# Altium schematic sheet Weerstation.SchDoc
size A3; SheetNumber: 1; SheetTotal: 1
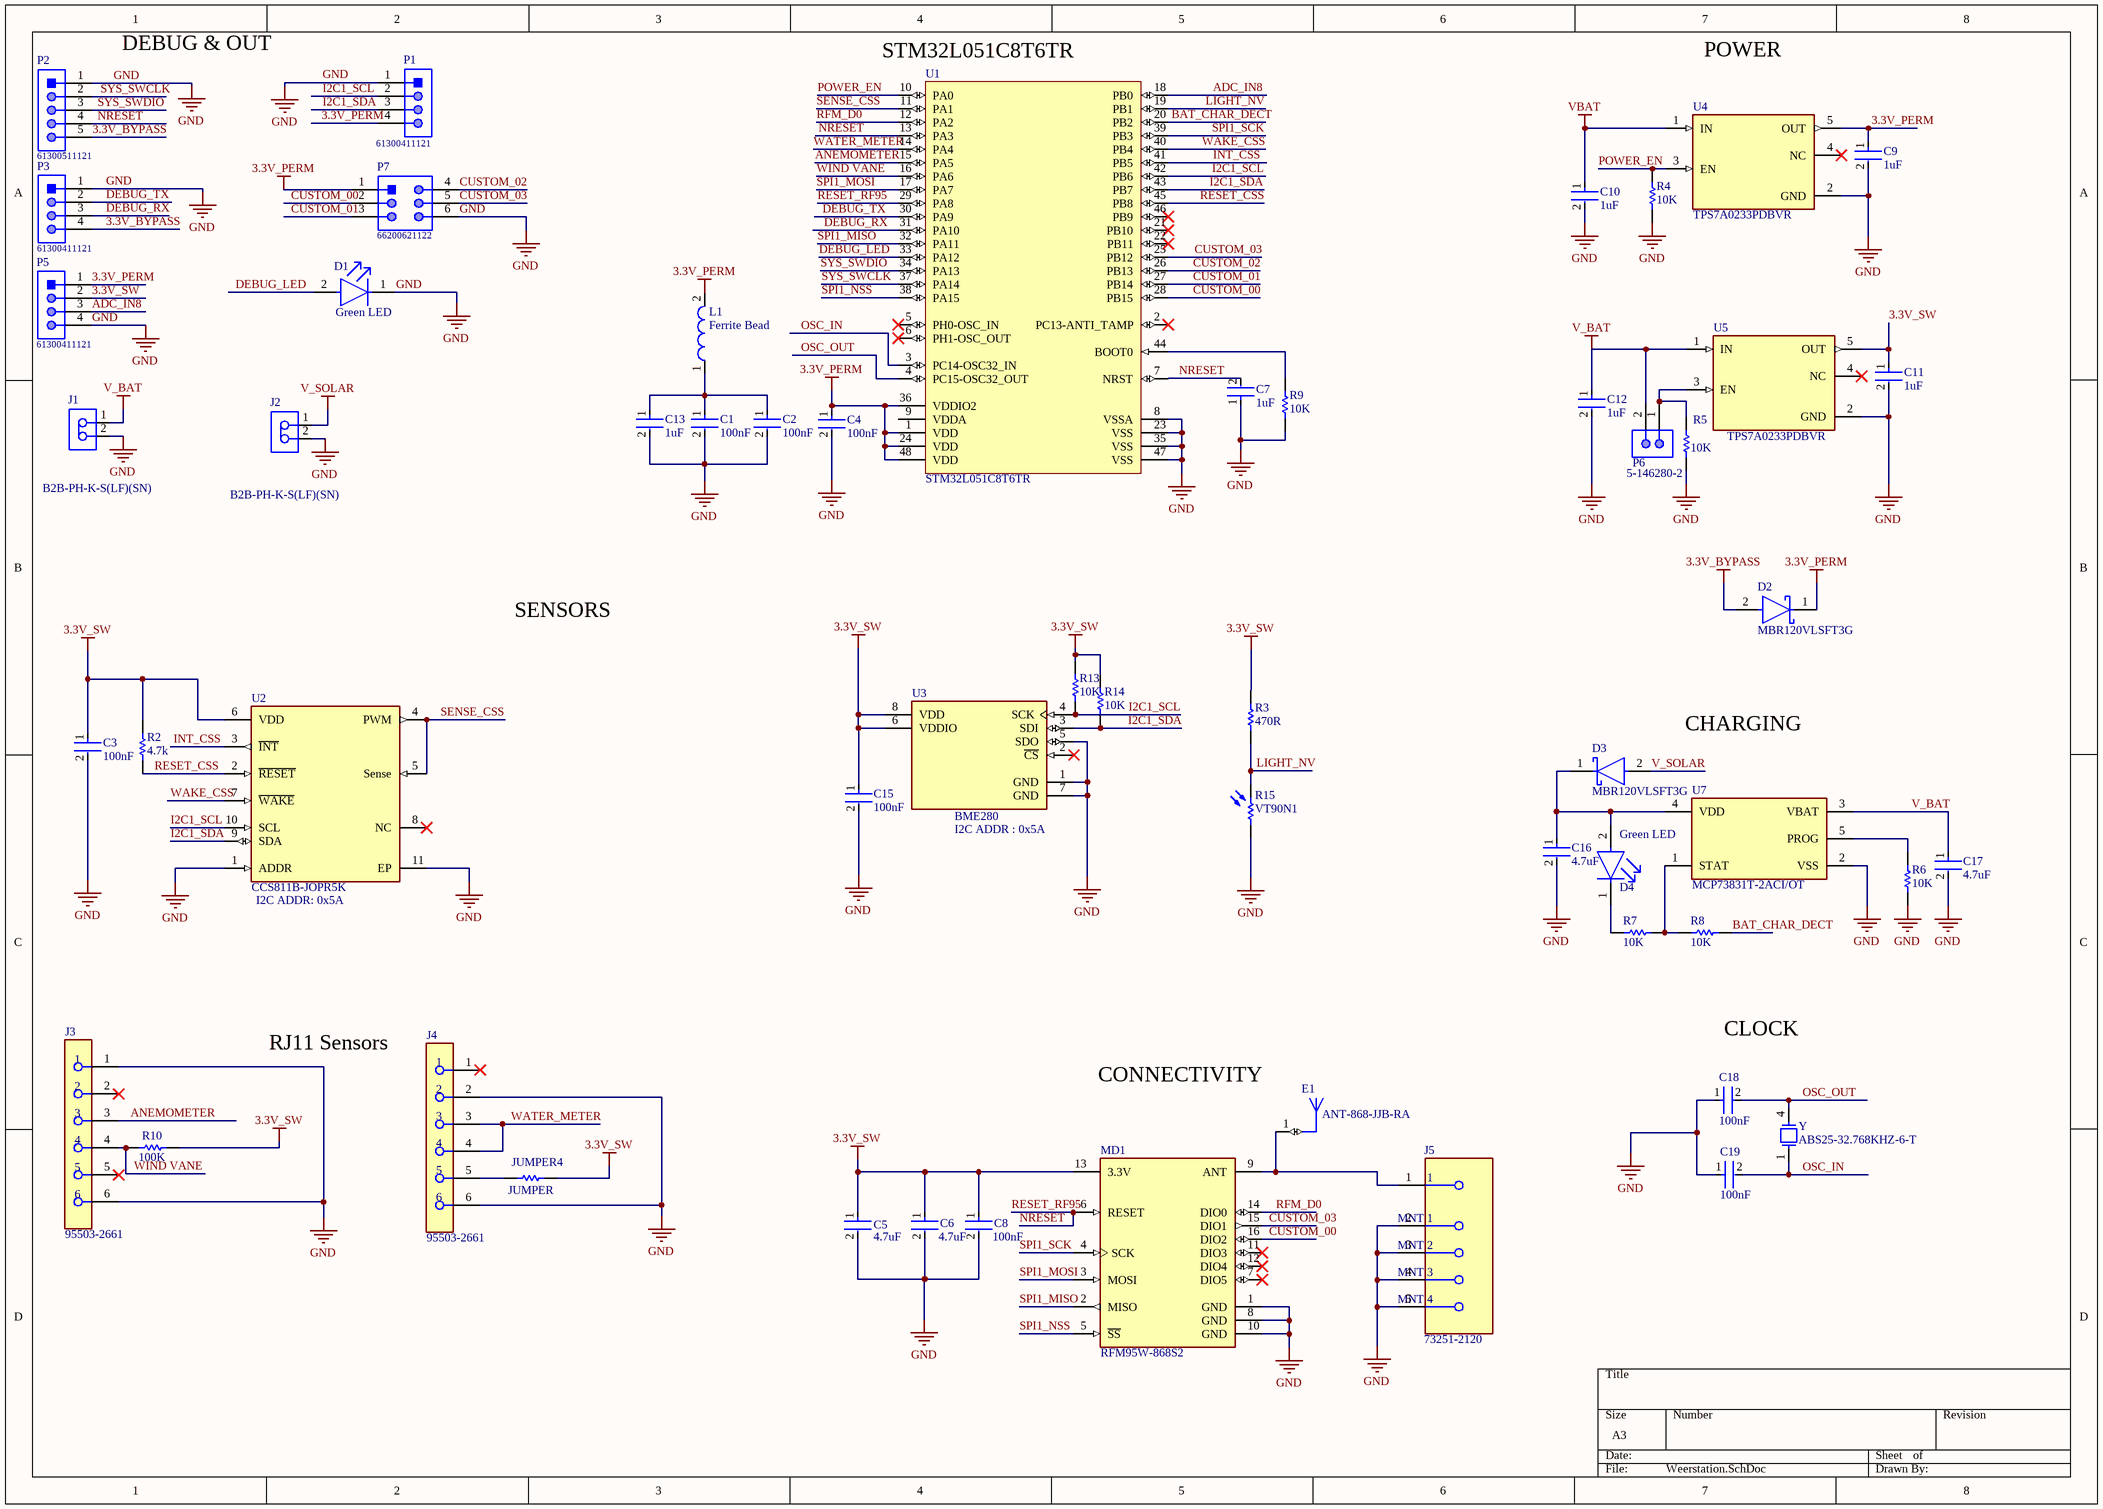
[diagram p0: Weerstation.SchDoc]

## Parts
C1  100nF  [FP-C0603C105K3PACTU-MFG]
C2  100nF  [FP-C0603C105K3PACTU-MFG]
C3  100nF  [FP-C0603C105K3PACTU-MFG]
C4  100nF  [FP-CGA3E-0_3-0_1-IPC_A]
C5  4.7uF  [FP-C0603-CG-MFG]
C6  4.7uF  [FP-C0603-CG-MFG]
C7  1uF  [FP-C0603C105K3PACTU-MFG]
C8  100nF  [FP-C0603C105K3PACTU-MFG]
C9  1uF  [FP-C0603C105K3PACTU-MFG]
C10  1uF  [FP-C0603-CG-MFG]
C11  1uF  [FP-C0603C105K3PACTU-MFG]
C12  1uF  [FP-C0603-CG-MFG]
C13  1uF  [FP-C0603C105K3PACTU-MFG]
C15  100nF  [FP-C0603C105K3PACTU-MFG]
C16  4.7uF  [FP-C0603-CG-MFG]
C17  4.7uF  [FP-C0603-CG-MFG]
C18  100nF  [FP-CGA3E-0_3-0_1-IPC_A]
C19  100nF  [FP-CGA3E-0_3-0_1-IPC_A]
D1  Green LED  [FP-LTST-C190GKT-MFG]
D2  MBR120VLSFT3G  [FP-498-MFG]
D3  MBR120VLSFT3G  [FP-498-MFG]
D4  Green LED  [FP-LTST-C190GKT-MFG]
E1  ANT-868-JJB-RA  [ANT-XXX-JJB-RA]
J1  B2B-PH-K-S(LF)(SN)  [JST-B2B-PH-K-S_V]
J2  B2B-PH-K-S(LF)(SN)  [JST-B2B-PH-K-S_V]
J3  95503-2661  [FP-95503-2661-MFG]
J4  95503-2661  [FP-95503-2661-MFG]
J5  73251-2120  [FP-73251-2120-MFG]
JUMPER4  JUMPER  [RESC2013X50X30LL20T20]
L1  Ferrite Bead  [SMD-0603]
MD1  RFM95W-868S2  [FP-RFM95W-868S2-MFG]
P1  61300411121  [61300411121]
P2  61300511121  [61300511121]
P3  61300411121  [61300411121]
P5  61300411121  [61300411121]
P6  5-146280-2  [TECO-5-146280-2_V]
P7  66200621122  [66200621122]
R2  4.7k  [RESC1608X55X30ML15T15]
R3  470R  [RESC1608X55X30ML15T15]
R4  10K  [RESC1608X55X30ML15T15]
R5  10K  [RESC1608X55X30ML15T15]
R6  10K  [RESC1608X55X30ML15T15]
R7  10K  [RESC1608X55X30ML15T15]
R8  10K  [RESC1608X55X30ML15T15]
R9  10K  [RESC1608X55X30ML15T15]
R10  100K  [RESC1608X55X30ML15T15]
R13  10K  [RESC1608X55X30ML15T15]
R14  10K  [RESC1608X55X30ML15T15]
R15  VT90N1  [EXCE-VT90N1]
U1  STM32L051C8T6TR  [STM-LQFP48_N]
U2  CCS811B-JOPR5K  [FP-CCS811B-JOPR5K-MFG]
U3  BME280  [FP-BME280-MFG]
U4  TPS7A0233PDBVR  [FP-DBV0005A-IPC_B]
U5  TPS7A0233PDBVR  [FP-DBV0005A-IPC_B]
U7  MCP73831T-2ACI/OT  [FP-C04-091-OT-IPC_A]
Y  ABS25-32.768KHZ-6-T  [XTAL_ABS25-32.768KHZ-6-T]

## Nets
3.3V_BYPASS: D2.2(A) P2.5 P3.4
3.3V_PERM: C4.1 C9.1 D2.1(C) L1.2 P1.4 P5.1 P7.1 U1.1(VDD) U1.24(VDD) U1.36(VDDIO2) U1.48(VDD) U4.5(OUT)
3.3V_SW: C3.1 C5.1 C6.1 C8.1 C11.1 C15.1 JUMPER4.1 MD1.13(3.3V) P5.2 R2.2 R3.1 R10.2 R13.1 R14.1 U2.6(VDD) U3.6(VDDIO) U3.8(VDD) U5.5(OUT)
GND: C1.2 C2.2 C3.2 C4.2 C5.2 C6.2 C7.1 C8.2 C9.2 C10.2 C11.2 C12.2 C13.2 C15.2 C16.2 C17.2 C18.1 C19.1 D1.1(C) J1.2 J2.2 J3.1 J3.6 J4.2 J4.6 J5.2(MNT_1) J5.3(MNT_2) J5.4(MNT_3) J5.5(MNT_4) MD1.1(GND) MD1.8(GND) MD1.10(GND) P1.1 P2.1 P3.1 P5.4 P7.6 R4.2 R5.2 R6.1 R9.1 R15.1 U1.8(VSSA) U1.23(VSS) U1.35(VSS) U1.47(VSS) U2.1(ADDR) U2.11(EP) U3.1(GND) U3.5(SDO) U3.7(GND) U4.2(GND) U5.2(GND) U7.2(VSS)
V_BAT: C12.1 C17.1 J1.1 P6.2 U5.1(IN) U7.3(VBAT)
V_SOLAR: D3.2(A) J2.1
VBAT: C10.1 U4.1(IN)
ADC_IN8: P5.3 U1.18(PB0)
ANEMOMETER: J3.3 U1.15(PA5)
BAT_CHAR_DECT: R8.1 U1.20(PB2)
CUSTOM_00: MD1.16(DIO2) P7.2 U1.28(PB15)
CUSTOM_01: P7.3 U1.27(PB14)
CUSTOM_02: P7.4 U1.26(PB13)
CUSTOM_03: MD1.15(DIO1) P7.5 U1.25(PB12)
DEBUG_LED: D1.2(A) U1.33(PA12)
DEBUG_RX: P3.3 U1.31(PA10)
DEBUG_TX: P3.2 U1.30(PA9)
I2C1_SCL: P1.2 R13.2 U1.42(PB6) U2.10(SCL) U3.4(SCK)
I2C1_SDA: P1.3 R14.2 U1.43(PB7) U2.9(SDA) U3.3(SDI)
INT_CSS: U1.41(PB5) U2.3(~{INT})
LIGHT_NV: R3.2 R15.2 U1.19(PB1)
NRESET: C7.2 MD1.6(RESET) P2.4 U1.7(NRST) U1.13(PA3) U1.29(PA8)  [also labelled RESET_RF95]
OSC_IN: C19.2 U1.3(PC14-OSC32_IN) Y.1
OSC_OUT: C18.2 U1.4(PC15-OSC32_OUT) Y.4
POWER_EN: R4.1 U1.10(PA0) U4.3(EN)
RESET_CSS: R2.1 U1.45(PB8) U2.2(~{RESET})
RFM_D0: MD1.14(DIO0) U1.12(PA2)
SENSE_CSS: U1.11(PA1) U2.4(PWM) U2.5(Sense)
SPI1_MISO: MD1.2(MISO) U1.32(PA11)
SPI1_MOSI: MD1.3(MOSI) U1.17(PA7)
SPI1_NSS: MD1.5(~{SS}) U1.38(PA15)
SPI1_SCK: MD1.4(SCK) U1.39(PB3)
SYS_SWCLK: P2.2 U1.37(PA14)
SYS_SWDIO: P2.3 U1.34(PA13)
WAKE_CSS: U1.40(PB4) U2.7(~{WAKE})
WATER_METER: J4.3 J4.4 U1.14(PA4)
WIND VANE: J3.4 R10.1 U1.16(PA6)
NetC1_1: C1.1 C2.1 C13.1 L1.1
NetC16_1: C16.1 D3.1(C) D4.2(A) U7.4(VDD)
NetD4_1: D4.1(C) R7.2
NetE1_1: E1.1(FEED) J5.1 MD1.9(ANT)
NetJ4_5: J4.5 JUMPER4.2
NetP6_1: P6.1 R5.1 U5.3(EN)
NetR6_2: R6.2 U7.5(PROG)
NetR7_1: R7.1 R8.2 U7.1(STAT)
NetR9_2: R9.2 U1.44(BOOT0)

Not connected (* = marked no-connect by the designer): J3 2* 5*; J4 1*; MD1 7(DIO5)* 11(DIO3)* 12(DIO4)*; U1 2(PC13-ANTI_TAMP)* 5(PH0-OSC_IN)* 6(PH1-OSC_OUT)* 9(VDDA) 21(PB10)* 22(PB11)* 46(PB9)*; U2 8(NC)*; U3 2(~{CS})*; U4 4(NC)*; U5 4(NC)*

## Notes on the sheet
- DEBUG & OUT
- (near U1) STM32L051C8T6TR
- POWER
- SENSORS
- CHARGING
- (near U3) I2C ADDR : 0x5A
- (near U2) I2C ADDR: 0x5A
- RJ11 Sensors
- CLOCK
- CONNECTIVITY

## Library data of the parts
C1-C3 C8 C15 = CMP-2006-02216-3: CAP CER 100nF 25V X5R 0603; Dielectric Material: Ceramic; Capacitance: 1uF; Tolerance: 10%; Contact Plating: Tin; Number of Pins: 2; Lead Free: Lead Free; Depth: 0.8mm; Length: 1.6mm; Mount: Surface Mount; Case Code (Metric): 1608; Max Operating Temperature: 85°C; Voltage: 25V; Voltage Rating (DC): 25V; REACH SVHC: No SVHC; Height: 0.8mm; Series: C0603C; Case/Package: 0603; Case Code (Imperial): 0603; RoHS Compliant: Yes; Dielectric: X5R; Packaging: Tape and Reel; Construction: Flat; Thickness: 0.034inch; Voltage Rating: 25V; Radiation Hardening: No; Width: 0.031inch; Min Operating Temperature: -55°C; Termination: SMD/SMT; Package Quantity: 4000
C4 = CMP-2000-07546-2: Cap Ceramic 100nF 50V X7R 10% Pad SMD 0603 +125°C Automotive T/R; Weight: 7.1E-05oz; Composition: Ceramic; Max Operating Temperature: 125°C; Termination: SMD/SMT; Dielectric: X7R; Length: 1.6mm; Package Quantity: 1; REACH SVHC: No SVHC; Lead Free: Lead Free; Case Code (Metric): 1608; Min Operating Temperature: -55°C; Packaging: Tape and Reel; Tolerance: 10%; Voltage Rating: 50V; Case Code (Imperial): 0603; Capacitance: 100nF; Case/Package: 0603; Voltage Rating (DC): 50V; Depth: 0.8mm; Radiation Hardening: No; Ratings: AEC-Q200; Mount: Surface Mount; Voltage: 50V; Thickness: 0.035inch; Width: 0.8mm; Height: 0.8mm
C5 C6 C10 C12 C16 C17 = CMP-2006-02256-2: CAP CER 4.7UF 6.3V X5R 0603; Manufacturer: Kemet; Manufacturer Part Number: C0603C475K9PACTU; Temperature Coefficient: 15%; Tolerance: 10%; Material: Ceramic; Device Class L3: Ceramic Capacitors; RoHS: TRUE; Value: 4.7uF; Lead Free: Yes; ComponentLink2Description: Datasheet; Mouser Description: Multilayer Ceramic Capacitors MLCC - SMD/SMT 6.3volts 4.7uF X5R 10%; Package: C0603-CG; Digikey Description: CAP CER 4.7UF 6.3V X5R 0603; ComponentLink2URL: https://content.kemet.com/datasheets/KEM_C1006_X5R_SMD.pdf; Category: Cap; Temperature Range Low: -55°C; Capacitance: 4.7uF; Temperature: -55°C to +85°C; Octopart: https://octopart.com/c0603c475k9pactu-kemet-104242; Ipc Land Pattern Name: CAPC16080X80; Voltage Rating: 6.3V; Temperature Range High: +85°C; Height: 0.9mm; Temperature Characteristic: X5R; Device Class L1: Passive Components; Automotive: No; Device Class L2: Capacitors
C7 C13 = CMP-2006-02216-3: CAP CER 1uF 25V X5R 0603; Dielectric Material: Ceramic; Tolerance: 10%; Contact Plating: Tin; Number of Pins: 2; Lead Free: Lead Free; Depth: 0.8mm; Length: 1.6mm; Mount: Surface Mount; Case Code (Metric): 1608; Max Operating Temperature: 85°C; Voltage: 25V; Voltage Rating (DC): 25V; REACH SVHC: No SVHC; Height: 0.8mm; Series: C0603C; Case/Package: 0603; Case Code (Imperial): 0603; Capacitance: 1uF; RoHS Compliant: Yes; Dielectric: X5R; Packaging: Tape and Reel; Construction: Flat; Thickness: 0.034inch; Voltage Rating: 25V; Radiation Hardening: No; Width: 0.031inch; Min Operating Temperature: -55°C; Termination: SMD/SMT; Package Quantity: 4000
C9 C11 = CMP-2006-02216-3: CAP CER 1UF 25V X5R 0603; Dielectric Material: Ceramic; Tolerance: 10%; Contact Plating: Tin; Number of Pins: 2; Lead Free: Lead Free; Depth: 0.8mm; Length: 1.6mm; Mount: Surface Mount; Case Code (Metric): 1608; Max Operating Temperature: 85°C; Voltage: 25V; Voltage Rating (DC): 25V; REACH SVHC: No SVHC; Height: 0.8mm; Series: C0603C; Case/Package: 0603; Case Code (Imperial): 0603; Capacitance: 1uF; RoHS Compliant: Yes; Dielectric: X5R; Packaging: Tape and Reel; Construction: Flat; Thickness: 0.034inch; Voltage Rating: 25V; Radiation Hardening: No; Width: 0.031inch; Min Operating Temperature: -55°C; Termination: SMD/SMT; Package Quantity: 4000
C18 C19 = b4654b650e69147ec39a6b967a45e02: Cap Ceramic 100nF 50V X7R 10% Pad SMD 0603 +125°C Automotive T/R; Weight: 7.1E-05oz; Composition: Ceramic; Max Operating Temperature: 125°C; Termination: SMD/SMT; Dielectric: X7R; Length: 1.6mm; Package Quantity: 1; REACH SVHC: No SVHC; Lead Free: Lead Free; Case Code (Metric): 1608; Min Operating Temperature: -55°C; Packaging: Tape and Reel; Tolerance: 10%; Voltage Rating: 50V; Case Code (Imperial): 0603; Capacitance: 100nF; Case/Package: 0603; Voltage Rating (DC): 50V; Depth: 0.8mm; Radiation Hardening: No; Ratings: AEC-Q200; Mount: Surface Mount; Voltage: 50V; Thickness: 0.035inch; Width: 0.8mm; Height: 0.8mm
D1 D4 = CMP-22017-000005-2: LED GREEN CLEAR CHIP SMD; Dominant Wavelength: 569nm; Reverse Voltage: 5V; Lens Color: Colorless; Viewing Angle: 130°; Voltage: 2V; Forward Current: 30mA; Power Dissipation: 100mW; Luminous Intensity: 6mcd; Number of LEDs: 1; Forward Voltage: 2.1V; Wavelength: 565nm; Test Current: 10mA; Min Operating Temperature: -55°C; Lens Style: Clear; Mount: Surface Mount; Width: 0.8mm; Packaging: Tape and Reel; Lens Transparency: Clear; Case Code (Metric): 1608; Depth: 0.8mm; Case Code (Imperial): 0603; Case/Package: 0603; Number of Pins: 2; Max Operating Temperature: 85°C; Lead Free: Lead Free; Number of Elements: 1; Length: 1.6mm; Height: 0.8mm; Package Quantity: 1; Power Rating: 100mW; Radiation Hardening: No; Illumination Color: Green; Color: Green
D2 D3 = CMP-1055-00447-2: DIODE SCHOTTKY 20V 1A SOD123FL; Peak Reverse Current: 600uA; Peak Non-Repetitive Surge Current: 45A; Forward Voltage: 340mV; Polarity: Standard; Element Configuration: Single; Max Repetitive Reverse Voltage (Vrrm): 20V; Max Operating Temperature: 125°C; Forward Current: 1A; Average Rectified Current: 1A; Package Quantity: 10000; Current Rating: 1A; Max Reverse Leakage Current: 600uA; Max Surge Current: 45A; Radiation Hardening: No; Min Operating Temperature: -65°C; Max Reverse Voltage (DC): 20V; Number of Pins: 2; Output Current: 1A; Halogen Free: Halogen Free; Packaging: Tape and Reel; Max Forward Surge Current (Ifsm): 45A; REACH SVHC: No SVHC; Voltage Rating (DC): 20V; Lead Free: Lead Free
E1 = CMP-0172-00026-1: Embeddable 1/4-wave Monopole Antenna, JJB Series, 868MHz, 7mm Dia. Package, Right-Angle; Note1: No ground planes or traces under the antenna; DatasheetVersion: Jul-2008; PackageReference: ANT-XXX-JJB-RA; PackageDescription: Antenna, Monopole, JJB Series, Thru-Hole, Right-Angle, 7.0 x 9.0 mm (Dia.xH typ); PackageVersion: Jul-2008
J1 J2 = CMP-2000-05162-1: Male Header, Pitch 2 mm, 1 x 2 Position, Height 6 mm, Tail Length 3.4 mm, -25 to 85 degC, RoHS, Bulk; Manufacturer: JST; Pitch: 2mm; Style/Orientation: StraightHeader/Plug; No of Positions: 2; Datasheet Version: Nov-08; Datasheet URL: http://datasheet.octopart.com/B2B-PH-K-S%28LF%29%28SN%29-JST-datasheet-8324864.pdf; Manufacturer URL: http://www.jst.com/home2.html; Type: ShroudedHeader; Termination: Crimp
J3 J4 = CMP-04778-000008-1: CONN MOD JACK 6P6C VERT UNSHLD; Pitch: 2.54mm; Number of Positions Loaded: 6; Voltage Rating (DC): 125V; Gender: Female; Number of Ports: 1; Shielding: Unshielded; Current Rating: 1.5A; Housing Color: Black; Series: 95503; Color: Black; Packaging: Tray; Contact Material: Copper Alloy; Number of Positions: 6; Mount: Through Hole; Width: 13.21mm; Contact Plating: Gold; Halogen Free: Low Halogen; Number of Contacts: 6; Depth: 15.08mm; Length: 13.21mm; Voltage Rating: 125V; Number of Ways: 6; Max Voltage Rating (DC): 125V; Package Quantity: 3094; Orientation: Straight; Max Operating Temperature: 80°C; Termination: Through Hole; Housing Material: Thermoplastic; Min Operating Temperature: -40°C
J5 = CMP-04764-000015-1: CONN SMA JACK STR 50OHM EDGE MNT; Gender: Female; Plating: Gold; Impedance: 50R; Body Material: Brass; Polarity: Standard; Mount: Edge; Contact Plating: Gold; Orientation: Straight; Lead Free: Lead Free; Contact Material: Copper; Termination: Solder; RoHS Compliant: Yes; Body Plating: Gold; Operating Frequency: N/A; Connector Type: SMA; Case/Package: SMA; Series: 73251; Halogen Free: Low Halogen; Radiation Hardening: No; Packaging: Bulk; Package Quantity: 1600
JUMPER4 = CMP-2001-04896-1: Manufacturer: Vishay Dale; Part Number: CRCW08050000Z0EA
L1 = CMP-0220-00185-1: SMD EMI Suppression Ferrite Bead WE-CBF, Z = 30 Ohm; Impedance: 30 Ohm; PackageReference: SMD-0603; ComponentLink2Description: Datasheet; ComponentLink1URL: http://www.we-online.com; PackageDescription: Chip Inductor, 2-Leads, Body 1.6 x 0.8 mm; ComponentLink1Description: Manufacturer Link; PackageVersion: 2009; ComponentLink2URL: http://www.we-online.de/katalog/media/pdf/742792601.pdf; DatasheetVersion: Dec-2005
MD1 = CMP-204316-000001-1: RX TXRX MODULE ISM < 1GHZ SMD; Data Rate: 300Kbps; Frequency: 868MHz; Sensitivity: -123dBm; Interface: SPI; Current - Transmitting: 120mA; Current - Receiving: 12.1mA; Max Operating Temperature: 70°C; Case/Package: SMD/SMT; Packaging: Bulk; Mount: Surface Mount; Min Operating Temperature: -20°C
P1 P3 P5 = CMP-1502-01064-1: THT Vertical Pin Header WR-PHD, Pitch 2.54 mm, Single Row, 4 pins; Manufacturer: Wurth Elektronik; Withstanding Voltage: 500VAC; Rated Current: 3A; Working Voltage: 250VAC; Pin Number: 4; Gender: Male; Contact Resistance: 20mOhm; Pitch: 2.54mm; Manufacturer URL: http://www.we-online.de; Operating Temperature: -40to105degC; Packaging: Bag; Mounting Technology: THT; Package Reference: 61300411121; Datasheet URL: https://katalog.we-online.de/em/datasheet/6130xx11121.pdf; Publisher: WurthElektronik; Part Number: 61300411121; Row Number: Single; Orientation: Vertical
P2 = CMP-1502-01068-1: THT Vertical Pin Header WR-PHD, Pitch 2.54 mm, Single Row, 5 pins; Manufacturer: Wurth Elektronik; Pin Number: 5; Contact Resistance: 20mOhm; Working Voltage: 250VAC; Pitch: 2.54mm; Withstanding Voltage: 500VAC; Rated Current: 3A; Gender: Male; Datasheet URL: https://katalog.we-online.de/em/datasheet/6130xx11121.pdf; Orientation: Vertical; Mounting Technology: THT; Row Number: Single; Package Reference: 61300511121; Publisher: WurthElektronik; Part Number: 61300511121; Packaging: Bag; Manufacturer URL: http://www.we-online.de; Operating Temperature: -40to105degC
P6 = CMP-2000-07492-1: Male Header, Pitch 2.54 mm, 1 x 2 Position, Height 8.21 mm, Tail Length 3.05 mm, -65 to 105 degC, RoHS, Bulk; Manufacturer: TE Connectivity; Mating Connector Lock: No(Without); Number of Positions: 2; Pitch: 2.54mm; PCB Mounting Orientation: Vertical; Keyed: No; Case\/Package: 100; Mating Post Length: 0.23inch; High Temperature Housing: Yes; Max Current Rating: 5A; PCB Thickness: 0.063inch; PCB Mount Retention: Without; Approvals: CSA; Current Rating: 3A; Radiation Hardening: No; Length: 4.67mm; Contact Mating Length: 0.23inch; Connector Type: Header; Number of Rows: 1; Termination Post Length: 0.12inch; Board Standoff: No(Without); Max Operating Temperature: 105degC; Contact Shape: Square; Selectively Loaded: No(Without); Gasket: No(Without); Number of Contacts: 2; Contact Gender: Male; Mating Alignment: No(Without); Manufacturer URL: http://www.te.com/; Datasheet URL: http://www.te.com/commerce/DocumentDelivery/DDEController?Action=showdoc&DocId=Customer+Drawing%7F146280%7FH1%7Fpdf%7FEnglish%7FENG_CD_146280_H1.pdf%7F5-146280-2; Mount: ThroughHole; Orientation: Straight; Packaging: Carton; Package Reference: 5-146280-2; Package Quantity: 500; Stabilizers: No(Without); Row Spacing: 2.54mm; Contact Material: CopperAlloy; Panel Mount Retention: No(Without); Datasheet Version: Rev. H1, 08/2016; Housing Colour: Black; Colour: Black; Package Description: Male Header, Pitch 2.54 mm, 1 x 2 Position, Height 8.21 mm, Tail Length 3.05 mm; Contact Plating: Matte; Housing Material: Polymer; Contact Protection: No(Without); Min Operating Temperature: -65degC; Mounting Technology: ThroughHole; Flammability Rating: UL94V-0; RoHSCompliant: true; Termination: ThroughHole; Depth: 2.34mm; High Speed Serial Data Connector: No
P7 = CMP-1502-00310-1: THT Male Header WR-MPC3, Vertical, Dual Row, pitch 3 mm, 6 pins; Manufacturer: Wurth Elektronik; Pitch: 3mm; Pin Number: 6; Working Voltage: 250VAC; Contact Resistance: 10mOhm; Datasheet URL: https://katalog.we-online.de/em/datasheet/6620xx21122.pdf; Orientation: Vertical; Part Number: 66200621122; Packaging: Tube; Publisher: WurthElektronik; Package Reference: 66200621122; Operating Temperature: -40to105degC; Gender: Male; Manufacturer URL: http://www.we-online.de; Mounting Technology: THT
R2 R4-R10 = CMP-2000-00182-1: Part Number: ERJ-3EKF1003V; Manufacturer: Panasonic
R3 = CMP-1012-00473-6: Chip Resistor, 470 Ohm, +/- 1%, 0.1 W, -55 to 155 degC, 0603 (1608 Metric), RoHS, Tape and Reel; Manufacturer: Panasonic; Voltage Rating: 75 V; Height: 0.45 mm; ComponentLink1Description: Manufacturer URL; Packaging: Tape and Reel; Max Operating Temperature: 155 degC; ComponentLink3Description: Package Specification; ComponentLink3URL: https://datasheet.ciiva.com/11808/0900766b80f806dd-11808207.pdf; ComponentLink2Description: Datasheet; RoHSCompliant: true; ComponentLink1URL: http://www.panasonic.com/; Min Operating Temperature: -55 degC; PackageReference: 0603; DatasheetVersion: 04/2015; REACH SVHC: Yes; Length: 1.6 mm; Mount: Surface Mount; Mounting Technology: Surface Mount; Pins: 2; ComponentLink2URL: http://industrial.panasonic.com/cdbs/www-data/pdf/RDA0000/AOA0000C86.pdf; PackageDescription: 2-Pin Surface Mount Device, Body 1.6 x 0.85 mm; Package Quantity: 1
R13 R14 = CMP-1012-00473-6: Chip Resistor, 10K, +/- 1%, 0.1 W, -55 to 155 degC, 0603 (1608 Metric), RoHS, Tape and Reel; Manufacturer: Panasonic; Voltage Rating: 75 V; Height: 0.45 mm; ComponentLink1Description: Manufacturer URL; Packaging: Tape and Reel; Max Operating Temperature: 155 degC; ComponentLink3Description: Package Specification; ComponentLink3URL: https://datasheet.ciiva.com/11808/0900766b80f806dd-11808207.pdf; ComponentLink2Description: Datasheet; RoHSCompliant: true; ComponentLink1URL: http://www.panasonic.com/; Min Operating Temperature: -55 degC; PackageReference: 0603; DatasheetVersion: 04/2015; REACH SVHC: Yes; Length: 1.6 mm; Mount: Surface Mount; Mounting Technology: Surface Mount; Pins: 2; ComponentLink2URL: http://industrial.panasonic.com/cdbs/www-data/pdf/RDA0000/AOA0000C86.pdf; PackageDescription: 2-Pin Surface Mount Device, Body 1.6 x 0.85 mm; Package Quantity: 1
R15 = CMP-2000-07406-1: Photoconductive Resistor, 200 kOhm, 100 V, 80 mW, -40 to 75 degC, 2-Pin THD, RoHS; Manufacturer: Excelitas Technology; SVHC: Cadmiumchloride(15-Jun-2015); Power Rating: 80mW; Resistance @ Lux: 12kohm; Voltage Rating: 100V; Product Range: -; Datasheet Version: 09/2006; Resistor Case Style: -; Operating Temperature Max: 75°C; Package Reference: VT90N1; Datasheet URL: http://datasheet.octopart.com/VT90N1-Excelitas-datasheet-10388451.pdf; Mounting Technology: ThroughHole; Operating Temperature Min: -40°C; Dark Resistance: 200kohm; Package Description: 2-Pin Through Hole Device, Body Width 4.17 mm (Max), Height 2.29 mm; Manufacturer URL: http://www.excelitas.com/Pages/Index.aspx; Packaging: Each
U1 = CMP-1546-00004-1: Ultra-Low-Power ARM Cortex-M0+ MCU, 64 KB Flash, 1.8 to 3.6 V, -40 to 85 degC, 48-Pin LQFP, RoHS, Tape and Reel; Flash: 64 KB; VDD Min: 1.8 V; RAM: 8 KB; Data EEPROM: 2 KB; VDD Max: 3.6 V; Temperature Max: 85 degC; PartNumber: STM32L051C8T6TR; ComponentLink1URL: http://www.st.com/web/en/home.html; ComponentLink1Description: Manufacturer URL; PackageDescription: 48-Pin Frame Chip Scale Package, Body 7 x 7 mm, Pitch 0.5 mm; ComponentLink3URL: http://www.st.com/st-web-ui/static/active/en/resource/technical/document/datasheet/DM00058181.pdf; Packing: Tape and Reel; Mounting Technology: Surface Mount; ComponentLink3Description: Package Specification; RoHS: TRUE; ComponentLink2Description: Datasheet; Temperature Min: -40 degC; DatasheetVersion: Rev. 4; ComponentLink2URL: http://www.st.com/st-web-ui/static/active/en/resource/technical/document/datasheet/DM00108219.pdf
U2 = CMP-22823-000001-1: CCS811B-JOPR5K LGA10 LF T&R; Operating Supply Current: 26mA; Min Operating Temperature: -5°C; Max Operating Temperature: 50°C
U3 = CMP-2000-05073-3: SENSOR PRESSURE HUMIDITY TEMP; Sensor Type: Temperature; Accuracy: 3%; Response Time: 1s; Output Type: SPI; Min Operating Temperature: -40°C; Max Operating Temperature: 85°C; Case/Package: LGA; Packaging: Cut Tape; Mount: Surface Mount; Lead Free: Lead Free; Number of Pins: 8
U4 U5 = CMP-04917-000286-1: IC REG LINEAR 3.3V 200MA SOT23-5; RoHS Compliant: Yes
U7 = CMP-0133-00143-2: IC CONTROLLR LI-ION 4.2V SOT23-5; Max Power Dissipation: 1.54W; Output Current: 500mA; Max Output Voltage: 4.5V; Number of Outputs: 1; Min Output Voltage: 4.168V; Min Supply Voltage: 3.75V; Max Input Voltage: 6V; Voltage Rating: 4.534V; Drain to Source Resistance: 350mR; Max Operating Temperature: 85°C; Length: 0.122inch; Number of Pins: 5; REACH SVHC: No SVHC; Radiation Hardening: No; Min Operating Temperature: -40°C; Weight: 0.00709oz; Contact Plating: Tin; Termination: SMD/SMT; Case/Package: SOT-23; Mount: Surface Mount; Width: 0.071inch; Packaging: Tape and Reel; Number of Cells: 1; Max Charge Current: 500mA; Height: 0.051inch; Number of Channels: 1; Output Voltage: 4.2V; Max Supply Voltage: 6V; Lead Free: Lead Free
Y = ABS25-32.768KHZ-6-T: 32.768kHz Â±20ppm Crystal 6pF 50 kOhms 4-SOJ, 5.50mm pitch; MF: Abracon; Price: None; SnapEDA_Link: https://www.snapeda.com/parts/ABS25-32.768KHZ-6-T/Abracon%20LLC/view-part/313683/?ref=snap; MP: ABS25-32.768KHZ-6-T; Availability: Unavailable; Value: *; Package: 4-4 Abracon